# Altium schematic sheet Power.SchDoc
size A4
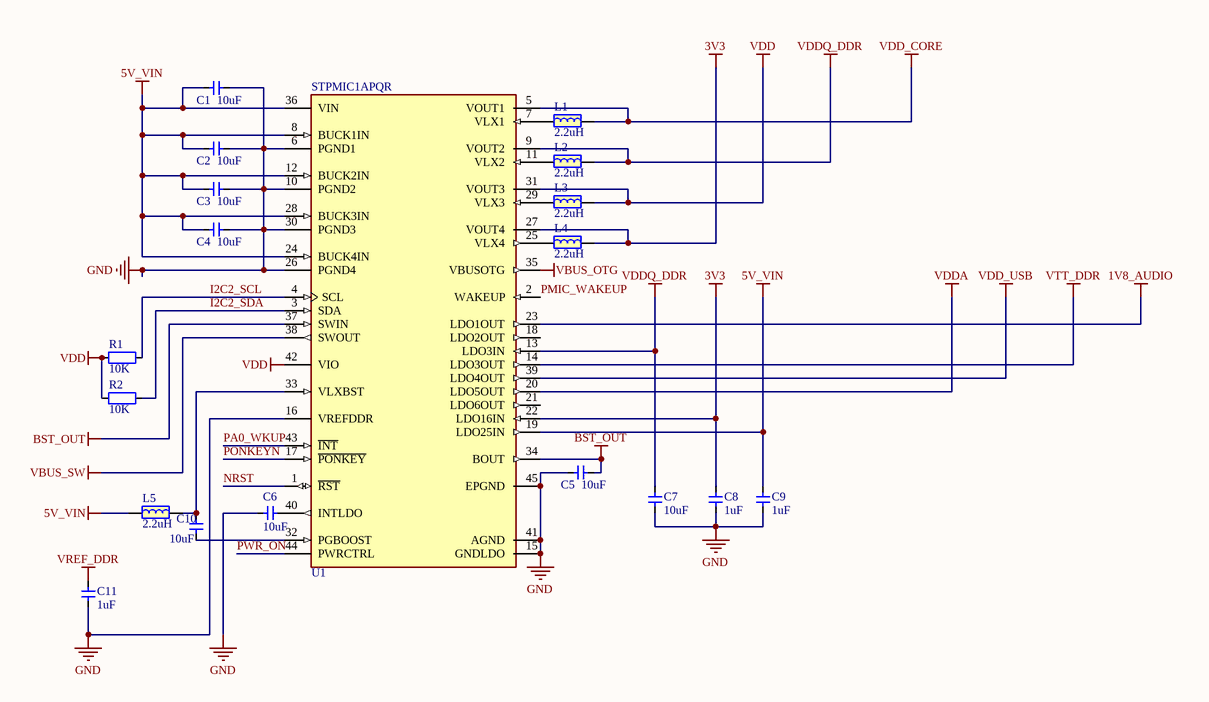
[diagram p0: Power.SchDoc]

## Parts
C1  10uF  [CAP_0402]
C2  10uF  [CAP_0402]
C3  10uF  [CAP_0402]
C4  10uF  [CAP_0402]
C5  10uF  [CAP_0402]
C6  10uF  [CAP_0402]
C7  10uF  [CAP_0402]
C8  1uF  [CAP_0402]
C9  1uF  [CAP_0402]
C10  10uF  [CAP_0402]
C11  1uF  [CAP_0402]
L1  2.2uH  [IND-201612]
L2  2.2uH  [IND-201612]
L3  2.2uH  [IND-201612]
L4  2.2uH  [IND-201612]
L5  2.2uH  [IND-201612]
R1  10K  [RES_0402]
R2  10K  [RES_0402]
U1  STPMIC1APQR  [STMicroelectronics_WFQFN44L_IPC_C]

## Nets
1V8_AUDIO: U1.23(LDO1OUT)
3V3: C8.2 L4.2 U1.22(LDO16IN) U1.27(VOUT4)
5V_VIN: C1.1 C2.1 C3.1 C4.1 C9.2 L5.1 U1.8(BUCK1IN) U1.12(BUCK2IN) U1.19(LDO25IN) U1.24(BUCK4IN) U1.28(BUCK3IN) U1.36(VIN)
BST_OUT: C5.2 U1.34(BOUT) U1.37(SWIN)
GND: C1.2 C2.2 C3.2 C4.2 C5.1 C6.2 C7.1 C8.1 C9.1 C11.1 U1.6(PGND1) U1.10(PGND2) U1.15(GNDLDO) U1.16(VREFDDR) U1.26(PGND4) U1.30(PGND3) U1.41(AGND) U1.45(EPGND)
VBUS_OTG: U1.35(VBUSOTG)
VBUS_SW: U1.38(SWOUT)
VDD: L3.2 R1.2 R2.2 U1.31(VOUT3) U1.42(VIO)
VDD_CORE: L1.2 U1.5(VOUT1)
VDD_USB: U1.39(LDO4OUT)
VDDA: U1.20(LDO5OUT)
VDDQ_DDR: C7.2 L2.2 U1.9(VOUT2) U1.13(LDO3IN)
VREF_DDR: C11.2
VTT_DDR: U1.14(LDO3OUT)
I2C2_SCL: R1.1 U1.4(SCL)
I2C2_SDA: R2.1 U1.3(SDA)
NRST: U1.1(~{RST})
PA0_WKUP: U1.43(~{INT})
PMIC_WAKEUP: U1.2(WAKEUP)
PONKEYN: U1.17(~{PONKEY})
PWR_ON: U1.44(PWRCTRL)
NetC6_1: C6.1 U1.40(INTLDO)
NetC10_1: C10.1 U1.32(PGBOOST)
NetC10_2: C10.2 L5.2 U1.33(VLXBST)
NetL1_1: L1.1 U1.7(VLX1)
NetL2_1: L2.1 U1.11(VLX2)
NetL3_1: L3.1 U1.29(VLX3)
NetL4_1: L4.1 U1.25(VLX4)

Not connected (* = marked no-connect by the designer): U1 18(LDO2OUT) 21(LDO6OUT)

## Library data of the parts
C1-C11 = 电容-0402: Capacitor; Value: 0.1u
L1-L5 = 电感-201612
R1 R2 = 电阻-0402: Resistor; Value: 22R